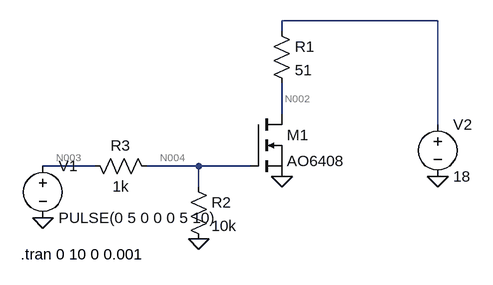
[diagram p0: schematic FET.asc]
FET.asc, the LTspice schematic file:
Version 4
SHEET 1 880 680
WIRE 544 -16 304 -16
WIRE 304 0 304 -16
WIRE 304 128 304 80
WIRE 544 144 544 -16
WIRE 16 208 -64 208
WIRE 176 208 96 208
WIRE 256 208 176 208
WIRE 176 240 176 208
FLAG 304 224 0
FLAG 176 320 0
FLAG -64 288 0
FLAG 544 224 0
SYMBOL nmos 256 128 R0
SYMATTR InstName M1
SYMATTR Value AO6408
SYMBOL res 288 -16 R0
SYMATTR InstName R1
SYMATTR Value 51
SYMBOL res 160 224 R0
SYMATTR InstName R2
SYMATTR Value 10k
SYMBOL res 0 192 M90
WINDOW 0 0 56 VBottom 2
WINDOW 3 32 56 VTop 2
SYMATTR InstName R3
SYMATTR Value 1k
SYMBOL voltage -64 192 R0
WINDOW 123 0 0 Left 2
WINDOW 39 0 0 Left 2
SYMATTR InstName V1
SYMATTR Value PULSE(0 5 0 0 0 5 10)
SYMBOL voltage 544 128 R0
WINDOW 123 0 0 Left 2
WINDOW 39 0 0 Left 2
SYMATTR InstName V2
SYMATTR Value 18
TEXT -98 344 Left 2 !.tran 0 10 0 0.001

The netlist it stands for:
* FET.asc
M1 N002 N004 0 0 AO6408
R1 N001 N002 51
R2 N004 0 10k
R3 N003 N004 1k
V1 N003 0 PULSE(0 5 0 0 0 5 10)
V2 N001 0 18
.model NMOS NMOS
.model PMOS PMOS
.lib standard.mos
.tran 0 10 0 0.001
.backanno
.end

* Results of the author's LTspice run, read from the files saved beside the schematic
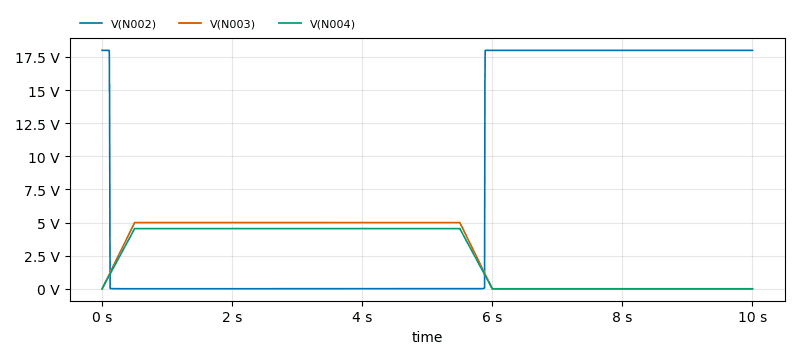
[diagram p1: Transient Analysis of FET.asc, plotted from the saved traces]
* Transient Analysis, 1 run:
*   V(N002): min 4.07 mV, max 18 V, average 7.622 V, rms 11.71 V, last 18 V
*   V(N003): min 0 V, max 5 V, average 2.75 V, rms 3.652 V, last 0 V
*   V(N004): min 0 V, max 4.545 V, average 2.5 V, rms 3.32 V, last 0 V